# EAGLE design Quimera_Power-distribution (EAGLE 7.5.0)
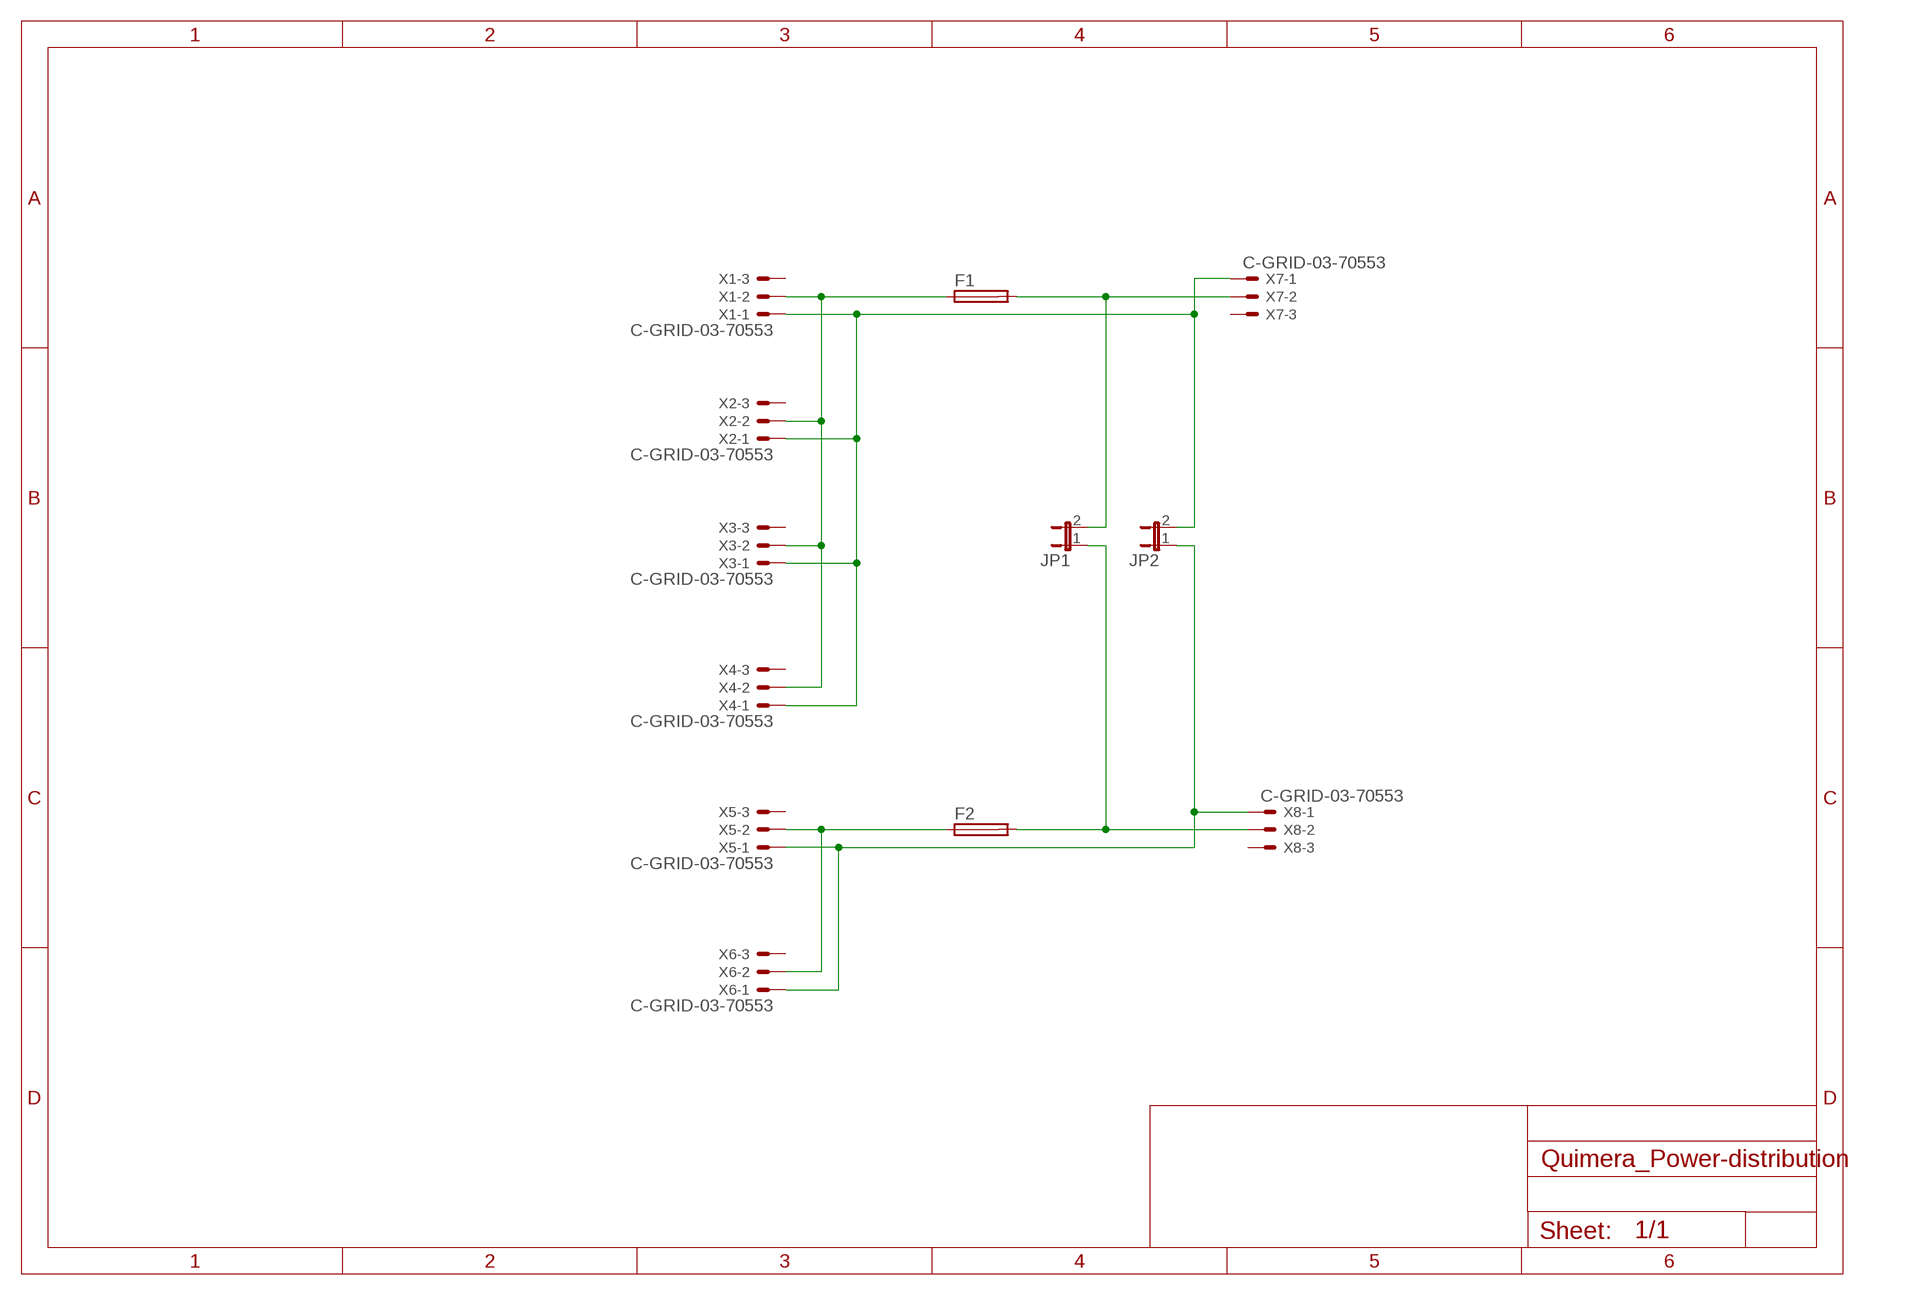
[diagram p0: schematic, sheet 1]

## Parts
F1  SH22,5A  [SH22,5A]
F2  SH22,5A  [SH22,5A]
JP1  JP1E  [JP1]
JP2  JP1E  [JP1]
X1  C-GRID-03-70553  [70553-03]
X2  C-GRID-03-70553  [70553-03]
X3  C-GRID-03-70553  [70553-03]
X4  C-GRID-03-70553  [70553-03]
X5  C-GRID-03-70553  [70553-03]
X6  C-GRID-03-70553  [70553-03]
X7  C-GRID-03-70553  [70553-03]
X8  C-GRID-03-70553  [70553-03]

## Nets
N$1: F1.1 X1.2 X2.2 X3.2 X4.2
N$2: F2.1 X5.2 X6.2
N$3: F1.2 JP1.2 X7.2
N$4: F2.2 JP1.1 X8.2
N$5: JP2.2 X1.1 X2.1 X3.1 X4.1 X7.1
N$6: JP2.1 X5.1 X6.1 X8.1
Unconnected: X1.3 X2.3 X3.3 X4.3 X5.3 X6.3 X7.3 X8.3

## Library data of the parts
F1 F2 = fuse:SH22,5A: FUSE HOLDER grid 22,5mm, isolated cap OGN0031 8201, Schurter (Buerklin); MPN: 0031.7701.11; OC_FARNELL: unknown; OC_NEWARK: 04F1224
JP1 JP2 = jumper:JP1E: JUMPER
X1-X8 = con-molex:C-GRID-03: CONNECTOR wire to board 2.54 mm (0.100") pitch header; OC_FARNELL: unknown; OC_NEWARK: unknown

## Board
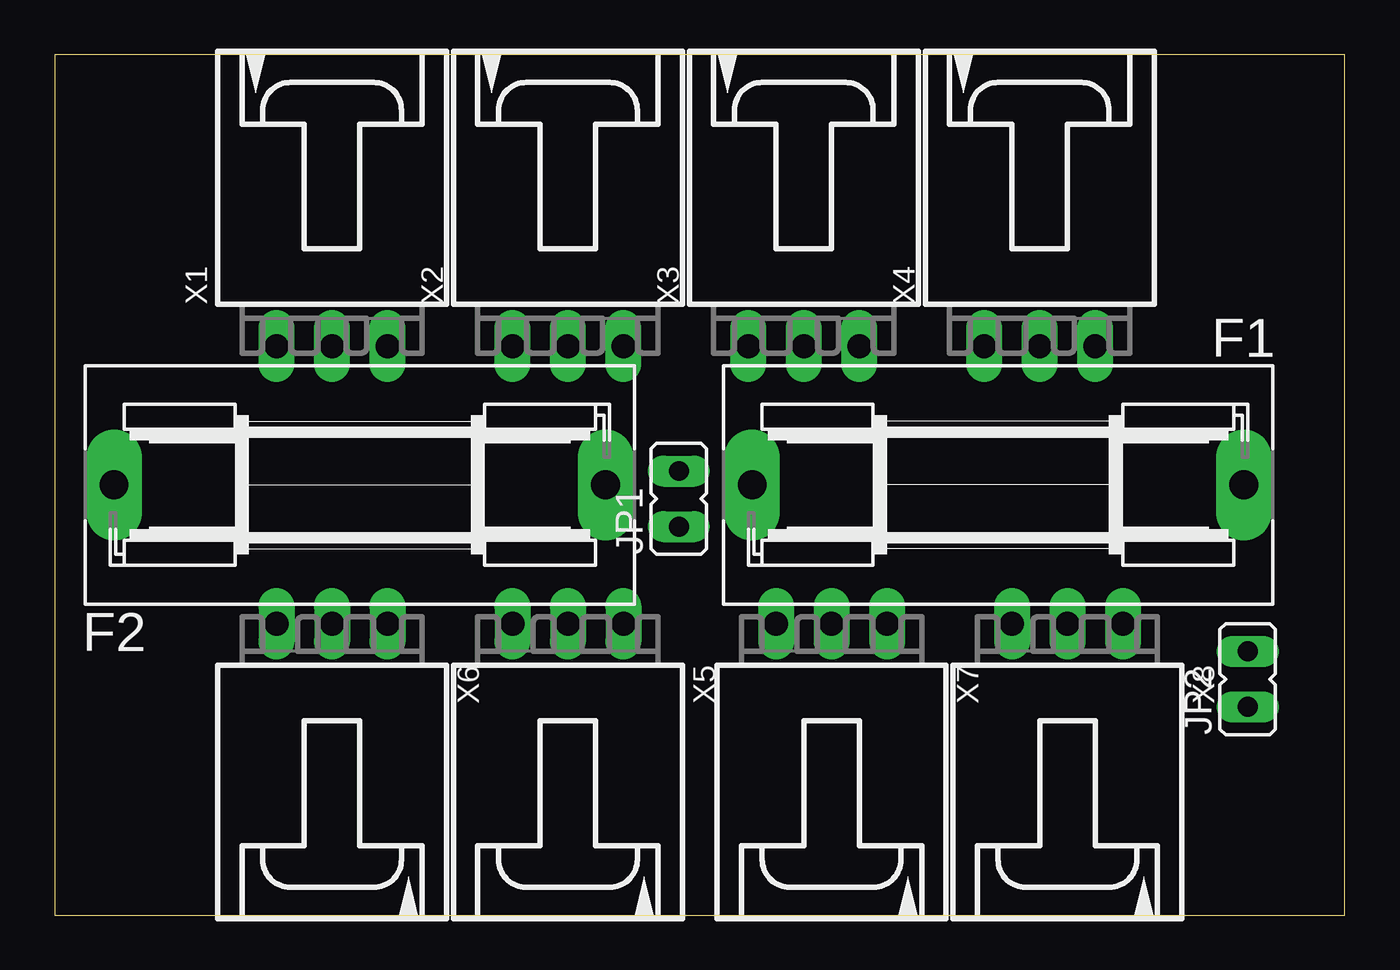
[diagram p1: board, top side]
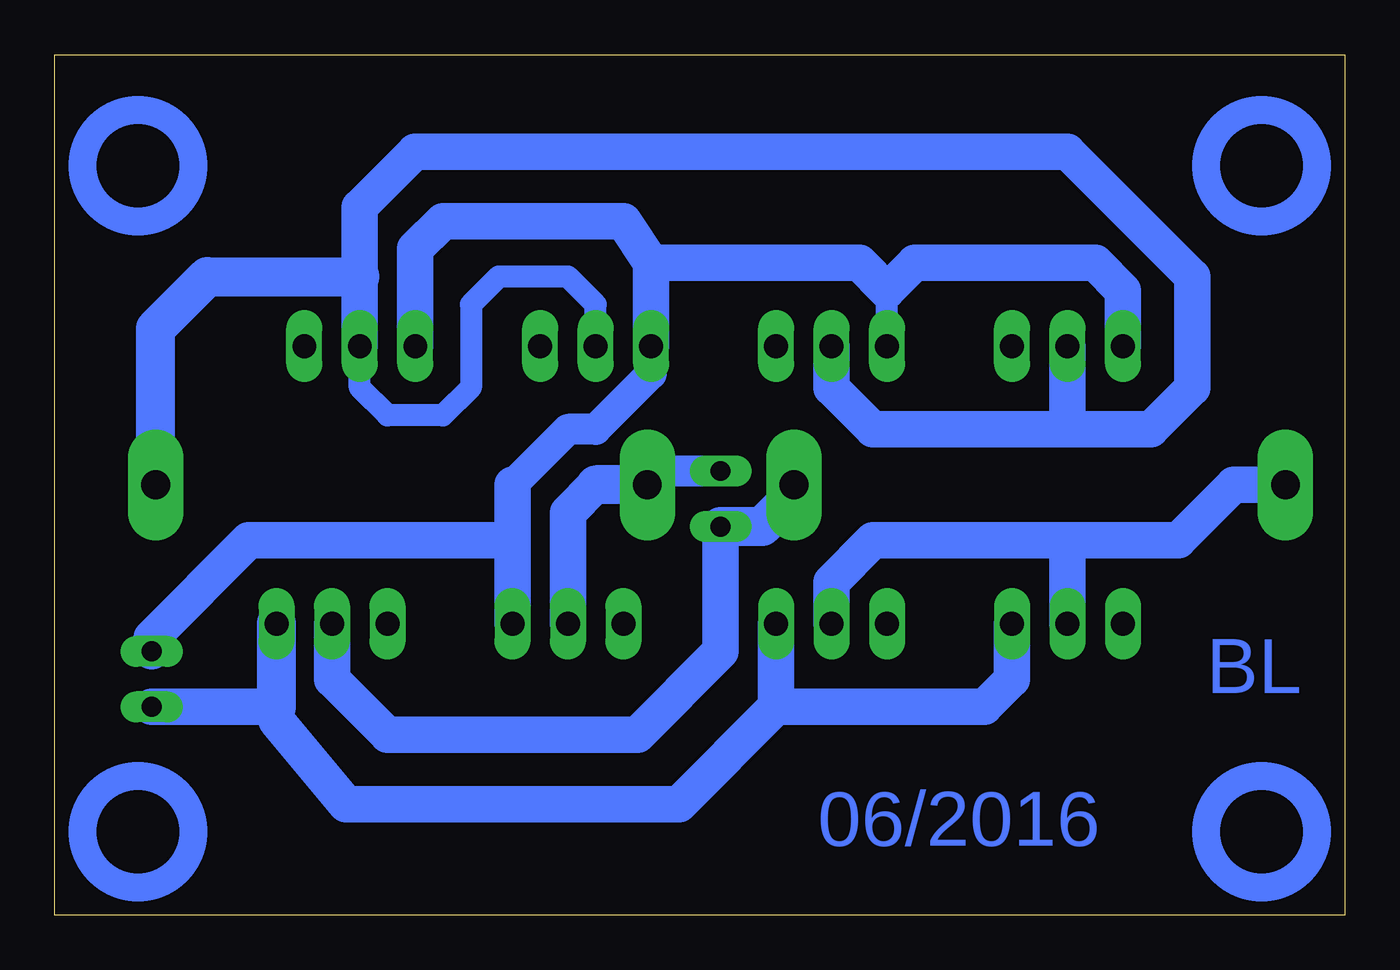
[diagram p2: board, bottom side, seen from below]

Size 59.05 x 39.37 mm. Coordinates in mm from the lower left corner, seen from the top.
Outline: 0,0 59.05,0 59.05,39.37 0,39.37 0,0
Copper layers (1*16): Top 0.035mm / dielectric 1.5mm / Bottom 0.035mm
Design rules "default": minimum track width 10mil, minimum drill 24mil, track to track 8mil, track to pad 8mil, pad to pad 8mil, via to via 8mil, smd to smd 8mil, copper to edge 40mil, drill to drill 8mil, minimum pad ring 10mil, minimum via ring 8mil, stop-mask expansion 4mil, vias tented up to drill 0mil, thermal gap 10mil

### Footprints (pad centres in the part's own frame; a part is rotated, then mirrored left to right if it is on the bottom)
SH22,5A = drill 1.321 pad 2.54 long: 1 -11.252,0; 2 11.252,0
JP1 = drill 0.914 long: 1 0,-1.27; 2 0,1.27
70553-03 = drill 1.092 long: 1 -2.54,-7.62; 2 0,-7.62; 3 2.54,-7.62

### Placement (x,y rotation side)
F1  43.18,19.68 180 top
F2  13.97,19.68 0 top
JP1  28.57,19.05 0 top
JP2  54.61,10.79 0 top
X1  12.7,33.66 0 top
X2  23.5,33.66 0 top
X3  34.29,33.66 0 top
X4  45.09,33.66 0 top
X5  23.5,5.71 180 top
X6  12.7,5.71 180 top
X7  35.56,5.71 180 top
X8  46.35,5.71 180 top

### Tracks (layer width: path | path; a pad name or v marks a point on that pad's centre or on a via)
N$1
  Bottom 1.016: X3.2 34.29,27.94 35.56,29.21 38.73,29.21 40.01,27.94 40.01,24.13 41.27,22.86 43.81,22.86 45.09,24.13 X4.2
  Bottom 1.676: X1.2 12.7,22.23 | 12.7,22.23 21.59,22.23 23.5,24.13 X2.2 | X4.2 45.09,29.21 45.09,32.38 42.55,34.92 12.7,34.92 6.99,29.21 6.99,24.13 8.89,22.23 12.7,22.23
  Bottom 1.778: F1.1 54.43,26.85 52.07,29.21 45.09,29.21
N$2
  Bottom 1.676: F2.1 5.08,19.68 7.62,17.14 12.7,17.14 | X6.2 12.7,17.14 | 12.7,17.14 21.59,17.14 23.5,15.24 X5.2
N$3
  Bottom 1.016: 31.29,19.05 F1.2 31.29,20.32
  Bottom 1.422: JP1.2 31.29,20.32
  Bottom 1.676: 34.29,19.68 35.56,18.41 X7.2
  Bottom 1.778: F1.2 34.29,19.68
N$4
  Bottom 1.676: JP1.1 28.57,12.06 32.38,8.26 43.81,8.26 46.35,10.79 X8.2
  Bottom 1.778: F2.2 25.22,19.23 26.67,17.78 JP1.1
N$5
  Bottom 1.016: X2.1 20.95,28.57
  Bottom 1.422: X3.1 31.75,24.77 34.29,22.23 35.56,22.23 38.1,19.68
  Bottom 1.676: X1.1 10.16,28.57 11.43,29.84 19.68,29.84 20.95,28.57 22.23,29.84 31.75,29.84 | X3.1 31.75,29.84 | 31.75,29.84 33.02,31.75 41.27,31.75 42.55,30.48 X4.1 | X7.1 38.1,17.14 | 38.1,17.14 50.16,17.14 54.61,12.7 JP2.2 | 38.1,19.68 38.1,17.14
N$6
  Bottom 1.016: 48.9,8.89 48.9,9.53
  Bottom 1.676: X5.1 26.04,9.53 | 26.04,9.53 30.48,5.08 45.72,5.08 48.9,8.89 | JP2.1 48.9,9.53 | X6.1 15.24,10.79 16.51,9.53 26.04,9.53
  Bottom 1.778: 48.9,9.53 X8.1
(copper drawn outside any net)
  shapes: Bottom circle x4

### Text on the board
Bottom: BL | 06/2016